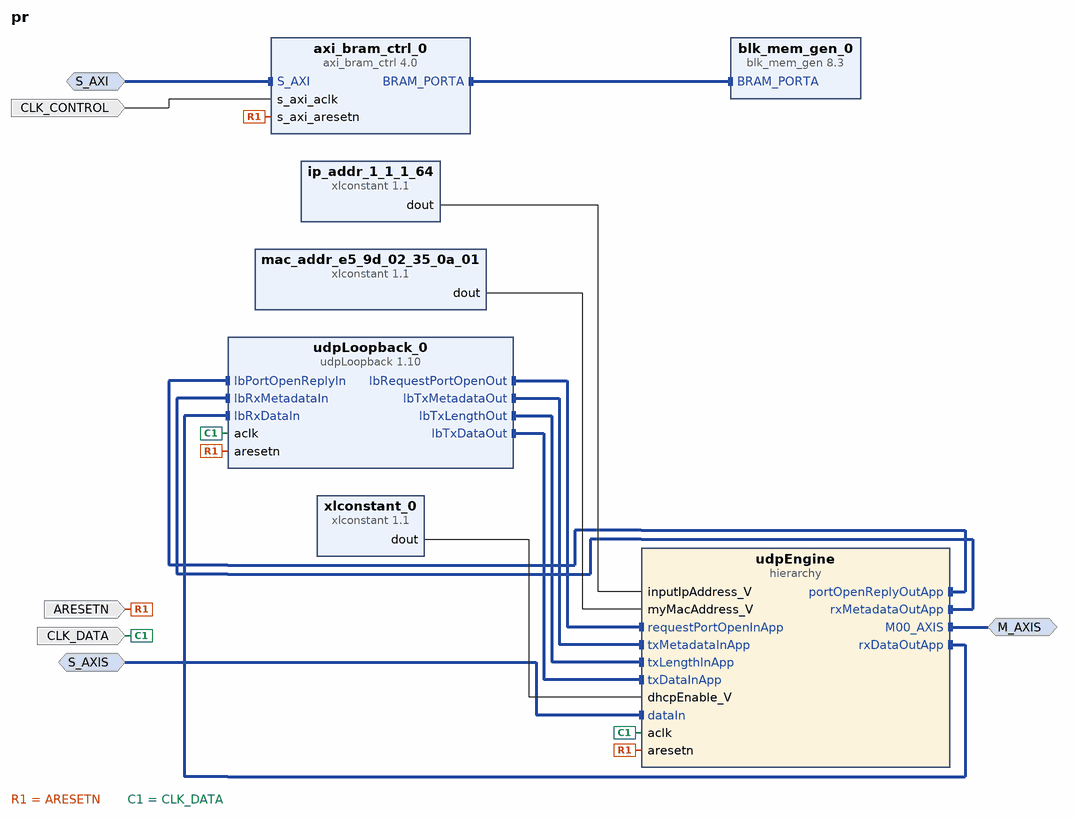
[diagram p0: block diagram of the top level]
# Vivado block design pr, xcku115-flva1517-2-e, Vivado 2016.4
create_bd_design pr

create_bd_intf_port -mode Slave -vlnv xilinx.com:interface:aximm_rtl:1.0 S_AXI
set_property -dict [list \
  CONFIG.DATA_WIDTH 64 \
  CONFIG.PROTOCOL AXI4 \
  CONFIG.ID_WIDTH 0 \
  CONFIG.ADDR_WIDTH 16 \
  CONFIG.AWUSER_WIDTH 0 \
  CONFIG.ARUSER_WIDTH 0 \
  CONFIG.WUSER_WIDTH 0 \
  CONFIG.RUSER_WIDTH 0 \
  CONFIG.BUSER_WIDTH 0 \
  CONFIG.READ_WRITE_MODE READ_WRITE \
  CONFIG.HAS_BURST 1 \
  CONFIG.HAS_LOCK 1 \
  CONFIG.HAS_PROT 1 \
  CONFIG.HAS_CACHE 1 \
  CONFIG.HAS_QOS 0 \
  CONFIG.HAS_REGION 0 \
  CONFIG.HAS_WSTRB 1 \
  CONFIG.HAS_BRESP 1 \
  CONFIG.HAS_RRESP 1 \
  CONFIG.SUPPORTS_NARROW_BURST 1 \
  CONFIG.NUM_READ_OUTSTANDING 2 \
  CONFIG.NUM_WRITE_OUTSTANDING 2 \
  CONFIG.MAX_BURST_LENGTH 256 \
  CONFIG.NUM_READ_THREADS 1 \
  CONFIG.NUM_WRITE_THREADS 1 \
  CONFIG.RUSER_BITS_PER_BYTE 0 \
  CONFIG.WUSER_BITS_PER_BYTE 0 \
] [get_bd_intf_ports S_AXI]
create_bd_intf_port -mode Slave -vlnv xilinx.com:interface:axis_rtl:1.0 S_AXIS
set_property -dict [list \
  CONFIG.TDATA_NUM_BYTES 8 \
  CONFIG.TDEST_WIDTH 0 \
  CONFIG.TID_WIDTH 0 \
  CONFIG.TUSER_WIDTH 0 \
  CONFIG.HAS_TREADY 1 \
  CONFIG.HAS_TSTRB 0 \
  CONFIG.HAS_TKEEP 1 \
  CONFIG.HAS_TLAST 1 \
  CONFIG.FREQ_HZ 156250000 \
  CONFIG.LAYERED_METADATA undef \
] [get_bd_intf_ports S_AXIS]
create_bd_intf_port -mode Master -vlnv xilinx.com:interface:axis_rtl:1.0 M_AXIS
set_property -dict {CONFIG.FREQ_HZ 156250000} [get_bd_intf_ports M_AXIS]
create_bd_port -dir I -type clk CLK_CONTROL
create_bd_port -dir I -type rst ARESETN
create_bd_port -dir I -type clk CLK_DATA
set_property -dict {CONFIG.FREQ_HZ 156250000} [get_bd_ports CLK_DATA]

create_bd_cell -type ip -vlnv xilinx.com:ip:blk_mem_gen:8.3 blk_mem_gen_0
create_bd_cell -type ip -vlnv xilinx.com:ip:axi_bram_ctrl:4.0 axi_bram_ctrl_0
set_property -dict {CONFIG.DATA_WIDTH 64 CONFIG.SINGLE_PORT_BRAM 1} [get_bd_cells axi_bram_ctrl_0]
create_bd_cell -type ip -vlnv xilinx.com:ip:xlconstant:1.1 xlconstant_0
set_property -dict {CONFIG.CONST_VAL 0} [get_bd_cells xlconstant_0]
create_bd_cell -type ip -vlnv xilinx.com:ip:xlconstant:1.1 ip_addr_1_1_1_64
set_property -dict {CONFIG.CONST_WIDTH 32 CONFIG.CONST_VAL 16843072} [get_bd_cells ip_addr_1_1_1_64]
create_bd_cell -type ip -vlnv xilinx.com:ip:xlconstant:1.1 mac_addr_e5_9d_02_35_0a_01
set_property -dict {CONFIG.CONST_WIDTH 48 CONFIG.CONST_VAL 252462509656577} [get_bd_cells mac_addr_e5_9d_02_35_0a_01]
create_bd_cell -type hier udpEngine
create_bd_cell -type ip -vlnv xilinx.labs:hls:udpLoopback:1.10 udpLoopback_0

# ---- hierarchy /udpEngine ----
current_bd_instance /udpEngine
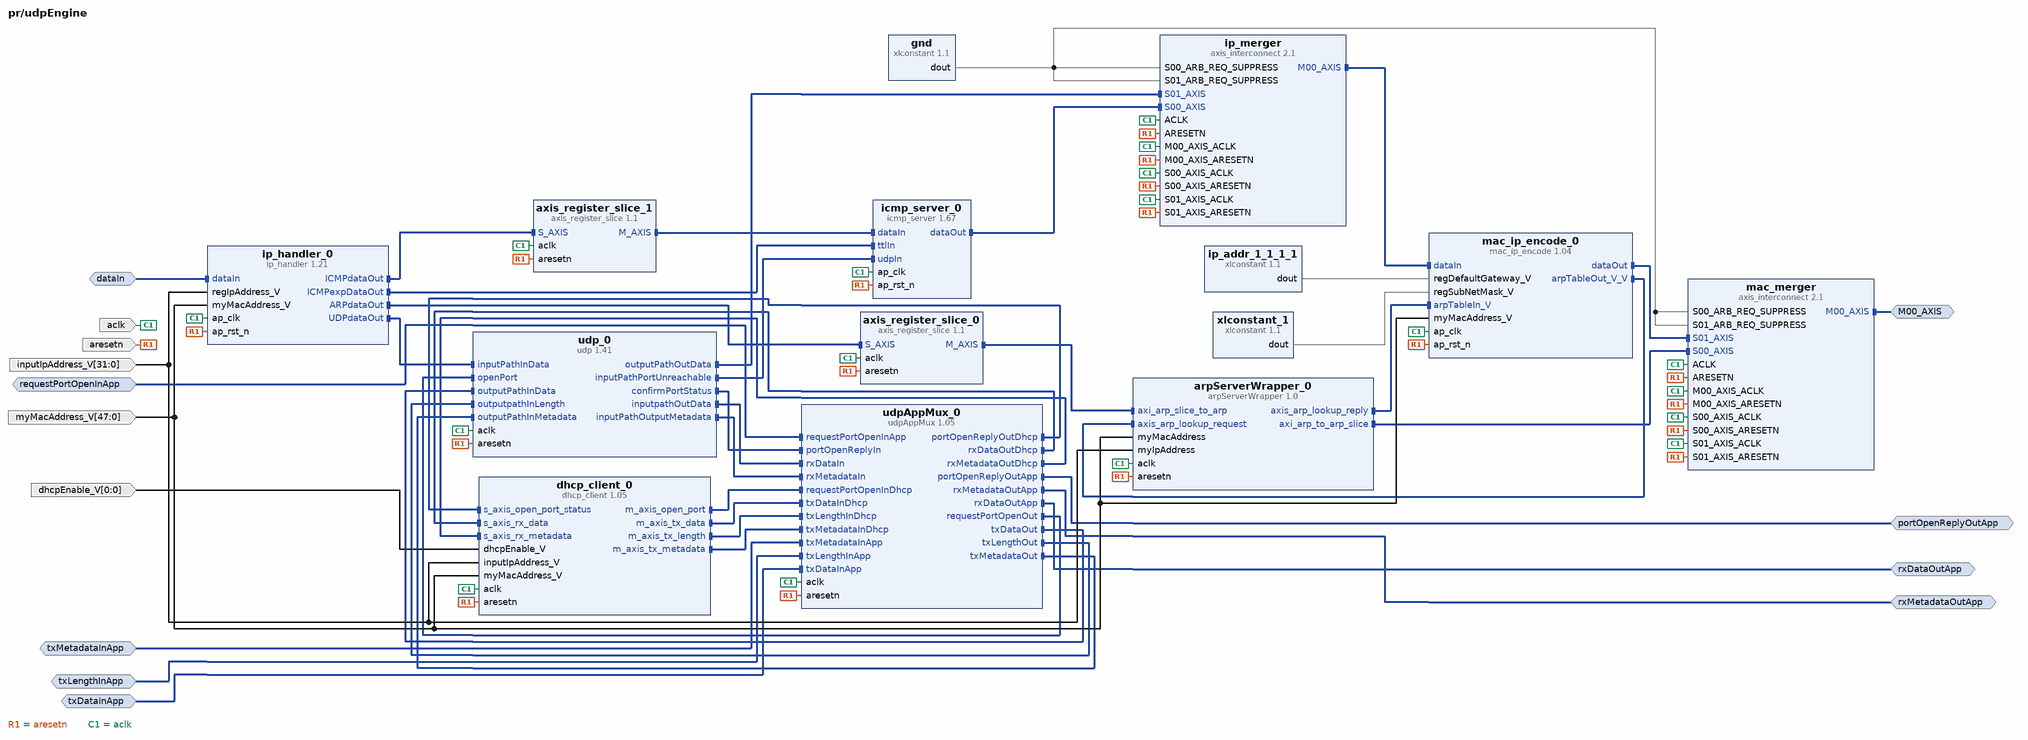
[diagram p1: block diagram inside /udpEngine]
create_bd_intf_pin -mode Slave -vlnv xilinx.com:interface:axis_rtl:1.0 dataIn
create_bd_intf_pin -mode Master -vlnv xilinx.com:interface:axis_rtl:1.0 M00_AXIS
create_bd_intf_pin -mode Slave -vlnv xilinx.com:interface:axis_rtl:1.0 requestPortOpenInApp
create_bd_intf_pin -mode Master -vlnv xilinx.com:interface:axis_rtl:1.0 portOpenReplyOutApp
create_bd_intf_pin -mode Master -vlnv xilinx.com:interface:axis_rtl:1.0 rxMetadataOutApp
create_bd_intf_pin -mode Slave -vlnv xilinx.com:interface:axis_rtl:1.0 txMetadataInApp
create_bd_intf_pin -mode Slave -vlnv xilinx.com:interface:axis_rtl:1.0 txLengthInApp
create_bd_intf_pin -mode Slave -vlnv xilinx.com:interface:axis_rtl:1.0 txDataInApp
create_bd_intf_pin -mode Master -vlnv xilinx.com:interface:axis_rtl:1.0 rxDataOutApp
create_bd_pin -dir I -type rst aresetn
create_bd_pin -dir I -type clk aclk
create_bd_pin -dir I -from 31 -to 0 inputIpAddress_V
create_bd_pin -dir I -from 47 -to 0 myMacAddress_V
create_bd_pin -dir I -from 0 -to 0 dhcpEnable_V

create_bd_cell -type ip -vlnv xilinx.labs:hls:dhcp_client:1.05 dhcp_client_0
create_bd_cell -type ip -vlnv xilinx.labs:hls:udpAppMux:1.05 udpAppMux_0
create_bd_cell -type ip -vlnv xilinx.labs:hls:ip_handler:1.21 ip_handler_0
create_bd_cell -type ip -vlnv xilinx.com:ip:axis_register_slice:1.1 axis_register_slice_0
create_bd_cell -type ip -vlnv user.org:user:arpServerWrapper:1.0 arpServerWrapper_0
create_bd_cell -type ip -vlnv xilinx.com:ip:axis_interconnect:2.1 mac_merger
set_property -dict {CONFIG.NUM_SI 2 CONFIG.NUM_MI 1 CONFIG.ARB_ON_MAX_XFERS 0 CONFIG.ARB_ON_TLAST 1} [get_bd_cells mac_merger]
create_bd_cell -type ip -vlnv xilinx.com:ip:xlconstant:1.1 gnd
set_property -dict {CONFIG.CONST_VAL 0} [get_bd_cells gnd]
create_bd_cell -type ip -vlnv xilinx.labs:hls:mac_ip_encode:1.04 mac_ip_encode_0
create_bd_cell -type ip -vlnv xilinx.com:ip:xlconstant:1.1 ip_addr_1_1_1_1
set_property -dict {CONFIG.CONST_WIDTH 32 CONFIG.CONST_VAL 16843011} [get_bd_cells ip_addr_1_1_1_1]
create_bd_cell -type ip -vlnv xilinx.com:ip:xlconstant:1.1 xlconstant_1
set_property -dict {CONFIG.CONST_WIDTH 32 CONFIG.CONST_VAL 16777215} [get_bd_cells xlconstant_1]
create_bd_cell -type ip -vlnv xilinx.labs:hls:udp:1.41 udp_0
create_bd_cell -type ip -vlnv xilinx.com:ip:axis_interconnect:2.1 ip_merger
set_property -dict {CONFIG.NUM_SI 2 CONFIG.NUM_MI 1 CONFIG.ARB_ON_MAX_XFERS 1 CONFIG.ARB_ON_TLAST 1} [get_bd_cells ip_merger]
create_bd_cell -type ip -vlnv xilinx.labs:hls:icmp_server:1.67 icmp_server_0
create_bd_cell -type ip -vlnv xilinx.com:ip:axis_register_slice:1.1 axis_register_slice_1

# ---- connections ----

current_bd_instance /udpEngine
connect_bd_intf_net [get_bd_intf_pins dhcp_client_0/m_axis_open_port] [get_bd_intf_pins udpAppMux_0/requestPortOpenInDhcp]
connect_bd_intf_net [get_bd_intf_pins dhcp_client_0/m_axis_tx_data] [get_bd_intf_pins udpAppMux_0/txDataInDhcp]
connect_bd_intf_net [get_bd_intf_pins dhcp_client_0/m_axis_tx_length] [get_bd_intf_pins udpAppMux_0/txLengthInDhcp]
connect_bd_intf_net [get_bd_intf_pins dhcp_client_0/m_axis_tx_metadata] [get_bd_intf_pins udpAppMux_0/txMetadataInDhcp]
connect_bd_intf_net [get_bd_intf_pins axis_register_slice_0/S_AXIS] [get_bd_intf_pins ip_handler_0/ARPdataOut]
connect_bd_intf_net [get_bd_intf_pins arpServerWrapper_0/axi_arp_slice_to_arp] [get_bd_intf_pins axis_register_slice_0/M_AXIS]
connect_bd_intf_net [get_bd_intf_pins arpServerWrapper_0/axi_arp_to_arp_slice] [get_bd_intf_pins mac_merger/S00_AXIS]
connect_bd_intf_net [get_bd_intf_pins mac_ip_encode_0/arpTableOut_V_V] [get_bd_intf_pins arpServerWrapper_0/axis_arp_lookup_request]
connect_bd_intf_net [get_bd_intf_pins arpServerWrapper_0/axis_arp_lookup_reply] [get_bd_intf_pins mac_ip_encode_0/arpTableIn_V]
connect_bd_intf_net [get_bd_intf_pins udp_0/confirmPortStatus] [get_bd_intf_pins udpAppMux_0/portOpenReplyIn]
connect_bd_intf_net [get_bd_intf_pins udp_0/inputpathOutData] [get_bd_intf_pins udpAppMux_0/rxDataIn]
connect_bd_intf_net [get_bd_intf_pins udp_0/outputPathOutData] [get_bd_intf_pins ip_merger/S01_AXIS]
connect_bd_intf_net [get_bd_intf_pins icmp_server_0/dataOut] [get_bd_intf_pins ip_merger/S00_AXIS]
connect_bd_intf_net [get_bd_intf_pins axis_register_slice_1/S_AXIS] [get_bd_intf_pins ip_handler_0/ICMPdataOut]
connect_bd_intf_net [get_bd_intf_pins axis_register_slice_1/M_AXIS] [get_bd_intf_pins icmp_server_0/dataIn]
connect_bd_intf_net [get_bd_intf_pins icmp_server_0/udpIn] [get_bd_intf_pins udp_0/inputPathPortUnreachable]
connect_bd_intf_net [get_bd_intf_pins udp_0/inputPathOutputMetadata] [get_bd_intf_pins udpAppMux_0/rxMetadataIn]
connect_bd_intf_net [get_bd_intf_pins ip_handler_0/ICMPexpDataOut] [get_bd_intf_pins icmp_server_0/ttlIn]
connect_bd_intf_net [get_bd_intf_pins ip_handler_0/UDPdataOut] [get_bd_intf_pins udp_0/inputPathInData]
connect_bd_intf_net [get_bd_intf_pins udp_0/openPort] [get_bd_intf_pins udpAppMux_0/requestPortOpenOut]
connect_bd_intf_net [get_bd_intf_pins udpAppMux_0/txDataOut] [get_bd_intf_pins udp_0/outputPathInData]
connect_bd_intf_net [get_bd_intf_pins udpAppMux_0/txLengthOut] [get_bd_intf_pins udp_0/outputpathInLength]
connect_bd_intf_net [get_bd_intf_pins udpAppMux_0/txMetadataOut] [get_bd_intf_pins udp_0/outputPathInMetadata]
connect_bd_intf_net [get_bd_intf_pins udpAppMux_0/portOpenReplyOutDhcp] [get_bd_intf_pins dhcp_client_0/s_axis_open_port_status]
connect_bd_intf_net [get_bd_intf_pins udpAppMux_0/rxDataOutDhcp] [get_bd_intf_pins dhcp_client_0/s_axis_rx_data]
connect_bd_intf_net [get_bd_intf_pins udpAppMux_0/rxMetadataOutDhcp] [get_bd_intf_pins dhcp_client_0/s_axis_rx_metadata]
connect_bd_intf_net [get_bd_intf_pins ip_merger/M00_AXIS] [get_bd_intf_pins mac_ip_encode_0/dataIn]
connect_bd_intf_net [get_bd_intf_pins mac_ip_encode_0/dataOut] [get_bd_intf_pins mac_merger/S01_AXIS]
connect_bd_intf_net [get_bd_intf_pins dataIn] [get_bd_intf_pins ip_handler_0/dataIn]
connect_bd_intf_net [get_bd_intf_pins M00_AXIS] [get_bd_intf_pins mac_merger/M00_AXIS]
connect_bd_intf_net [get_bd_intf_pins requestPortOpenInApp] [get_bd_intf_pins udpAppMux_0/requestPortOpenInApp]
connect_bd_intf_net [get_bd_intf_pins portOpenReplyOutApp] [get_bd_intf_pins udpAppMux_0/portOpenReplyOutApp]
connect_bd_intf_net [get_bd_intf_pins rxMetadataOutApp] [get_bd_intf_pins udpAppMux_0/rxMetadataOutApp]
connect_bd_intf_net [get_bd_intf_pins txMetadataInApp] [get_bd_intf_pins udpAppMux_0/txMetadataInApp]
connect_bd_intf_net [get_bd_intf_pins txLengthInApp] [get_bd_intf_pins udpAppMux_0/txLengthInApp]
connect_bd_intf_net [get_bd_intf_pins txDataInApp] [get_bd_intf_pins udpAppMux_0/txDataInApp]
connect_bd_intf_net [get_bd_intf_pins rxDataOutApp] [get_bd_intf_pins udpAppMux_0/rxDataOutApp]
connect_bd_net [get_bd_pins aresetn] \
  [get_bd_pins dhcp_client_0/aresetn] [get_bd_pins udpAppMux_0/aresetn] [get_bd_pins ip_handler_0/ap_rst_n] \
  [get_bd_pins axis_register_slice_0/aresetn] [get_bd_pins mac_merger/S01_AXIS_ARESETN] \
  [get_bd_pins mac_merger/M00_AXIS_ARESETN] [get_bd_pins mac_merger/S00_AXIS_ARESETN] [get_bd_pins mac_merger/ARESETN] \
  [get_bd_pins arpServerWrapper_0/aresetn] [get_bd_pins mac_ip_encode_0/ap_rst_n] [get_bd_pins ip_merger/ARESETN] \
  [get_bd_pins ip_merger/S00_AXIS_ARESETN] [get_bd_pins ip_merger/M00_AXIS_ARESETN] [get_bd_pins ip_merger/S01_AXIS_ARESETN] \
  [get_bd_pins axis_register_slice_1/aresetn] [get_bd_pins icmp_server_0/ap_rst_n] [get_bd_pins udp_0/aresetn]
connect_bd_net [get_bd_pins aclk] \
  [get_bd_pins dhcp_client_0/aclk] [get_bd_pins udpAppMux_0/aclk] [get_bd_pins ip_handler_0/ap_clk] \
  [get_bd_pins axis_register_slice_0/aclk] [get_bd_pins mac_merger/S01_AXIS_ACLK] [get_bd_pins mac_merger/M00_AXIS_ACLK] \
  [get_bd_pins mac_merger/S00_AXIS_ACLK] [get_bd_pins mac_merger/ACLK] [get_bd_pins arpServerWrapper_0/aclk] \
  [get_bd_pins mac_ip_encode_0/ap_clk] [get_bd_pins ip_merger/ACLK] [get_bd_pins ip_merger/S00_AXIS_ACLK] \
  [get_bd_pins ip_merger/M00_AXIS_ACLK] [get_bd_pins ip_merger/S01_AXIS_ACLK] [get_bd_pins axis_register_slice_1/aclk] \
  [get_bd_pins icmp_server_0/ap_clk] [get_bd_pins udp_0/aclk]
connect_bd_net [get_bd_pins inputIpAddress_V] \
  [get_bd_pins dhcp_client_0/inputIpAddress_V] [get_bd_pins ip_handler_0/regIpAddress_V] \
  [get_bd_pins arpServerWrapper_0/myIpAddress]
connect_bd_net [get_bd_pins myMacAddress_V] \
  [get_bd_pins dhcp_client_0/myMacAddress_V] [get_bd_pins ip_handler_0/myMacAddress_V] \
  [get_bd_pins arpServerWrapper_0/myMacAddress] [get_bd_pins mac_ip_encode_0/myMacAddress_V]
connect_bd_net [get_bd_pins dhcpEnable_V] [get_bd_pins dhcp_client_0/dhcpEnable_V]
connect_bd_net [get_bd_pins gnd/dout] \
  [get_bd_pins mac_merger/S00_ARB_REQ_SUPPRESS] [get_bd_pins mac_merger/S01_ARB_REQ_SUPPRESS] \
  [get_bd_pins ip_merger/S00_ARB_REQ_SUPPRESS] [get_bd_pins ip_merger/S01_ARB_REQ_SUPPRESS]
connect_bd_net [get_bd_pins ip_addr_1_1_1_1/dout] [get_bd_pins mac_ip_encode_0/regDefaultGateway_V]
connect_bd_net [get_bd_pins xlconstant_1/dout] [get_bd_pins mac_ip_encode_0/regSubNetMask_V]

current_bd_instance /
connect_bd_intf_net [get_bd_intf_pins axi_bram_ctrl_0/BRAM_PORTA] [get_bd_intf_pins blk_mem_gen_0/BRAM_PORTA]
connect_bd_intf_net [get_bd_intf_pins udpLoopback_0/lbRequestPortOpenOut] [get_bd_intf_pins udpEngine/requestPortOpenInApp]
connect_bd_intf_net [get_bd_intf_pins udpLoopback_0/lbPortOpenReplyIn] [get_bd_intf_pins udpEngine/portOpenReplyOutApp]
connect_bd_intf_net [get_bd_intf_pins udpLoopback_0/lbRxMetadataIn] [get_bd_intf_pins udpEngine/rxMetadataOutApp]
connect_bd_intf_net [get_bd_intf_pins udpLoopback_0/lbTxMetadataOut] [get_bd_intf_pins udpEngine/txMetadataInApp]
connect_bd_intf_net [get_bd_intf_pins udpLoopback_0/lbTxLengthOut] [get_bd_intf_pins udpEngine/txLengthInApp]
connect_bd_intf_net [get_bd_intf_pins udpLoopback_0/lbTxDataOut] [get_bd_intf_pins udpEngine/txDataInApp]
connect_bd_intf_net [get_bd_intf_pins udpLoopback_0/lbRxDataIn] [get_bd_intf_pins udpEngine/rxDataOutApp]
connect_bd_intf_net [get_bd_intf_ports S_AXI] [get_bd_intf_pins axi_bram_ctrl_0/S_AXI]
connect_bd_intf_net [get_bd_intf_ports S_AXIS] [get_bd_intf_pins udpEngine/dataIn]
connect_bd_intf_net [get_bd_intf_ports M_AXIS] [get_bd_intf_pins udpEngine/M00_AXIS]
connect_bd_net -net s_axi_aclk_1 [get_bd_ports CLK_CONTROL] [get_bd_pins axi_bram_ctrl_0/s_axi_aclk]
connect_bd_net -net s_axi_aresetn_1 [get_bd_ports ARESETN] \
  [get_bd_pins axi_bram_ctrl_0/s_axi_aresetn] [get_bd_pins udpEngine/aresetn] [get_bd_pins udpLoopback_0/aresetn]
connect_bd_net -net s_axis_aclk_1 [get_bd_ports CLK_DATA] [get_bd_pins udpEngine/aclk] [get_bd_pins udpLoopback_0/aclk]
connect_bd_net -net ip_addr_1_1_1_3_dout [get_bd_pins ip_addr_1_1_1_64/dout] [get_bd_pins udpEngine/inputIpAddress_V]
connect_bd_net [get_bd_pins mac_addr_e5_9d_02_35_0a_01/dout] [get_bd_pins udpEngine/myMacAddress_V]
connect_bd_net [get_bd_pins xlconstant_0/dout] [get_bd_pins udpEngine/dhcpEnable_V]

# ---- address map ----
assign_bd_address -offset 0x0000 -range 8K -target_address_space [get_bd_addr_spaces S_AXI] [get_bd_addr_segs axi_bram_ctrl_0/S_AXI/Mem0]

validate_bd_design
save_bd_design
